# EAGLE design 4x4_numpad (EAGLE 8.3.0)
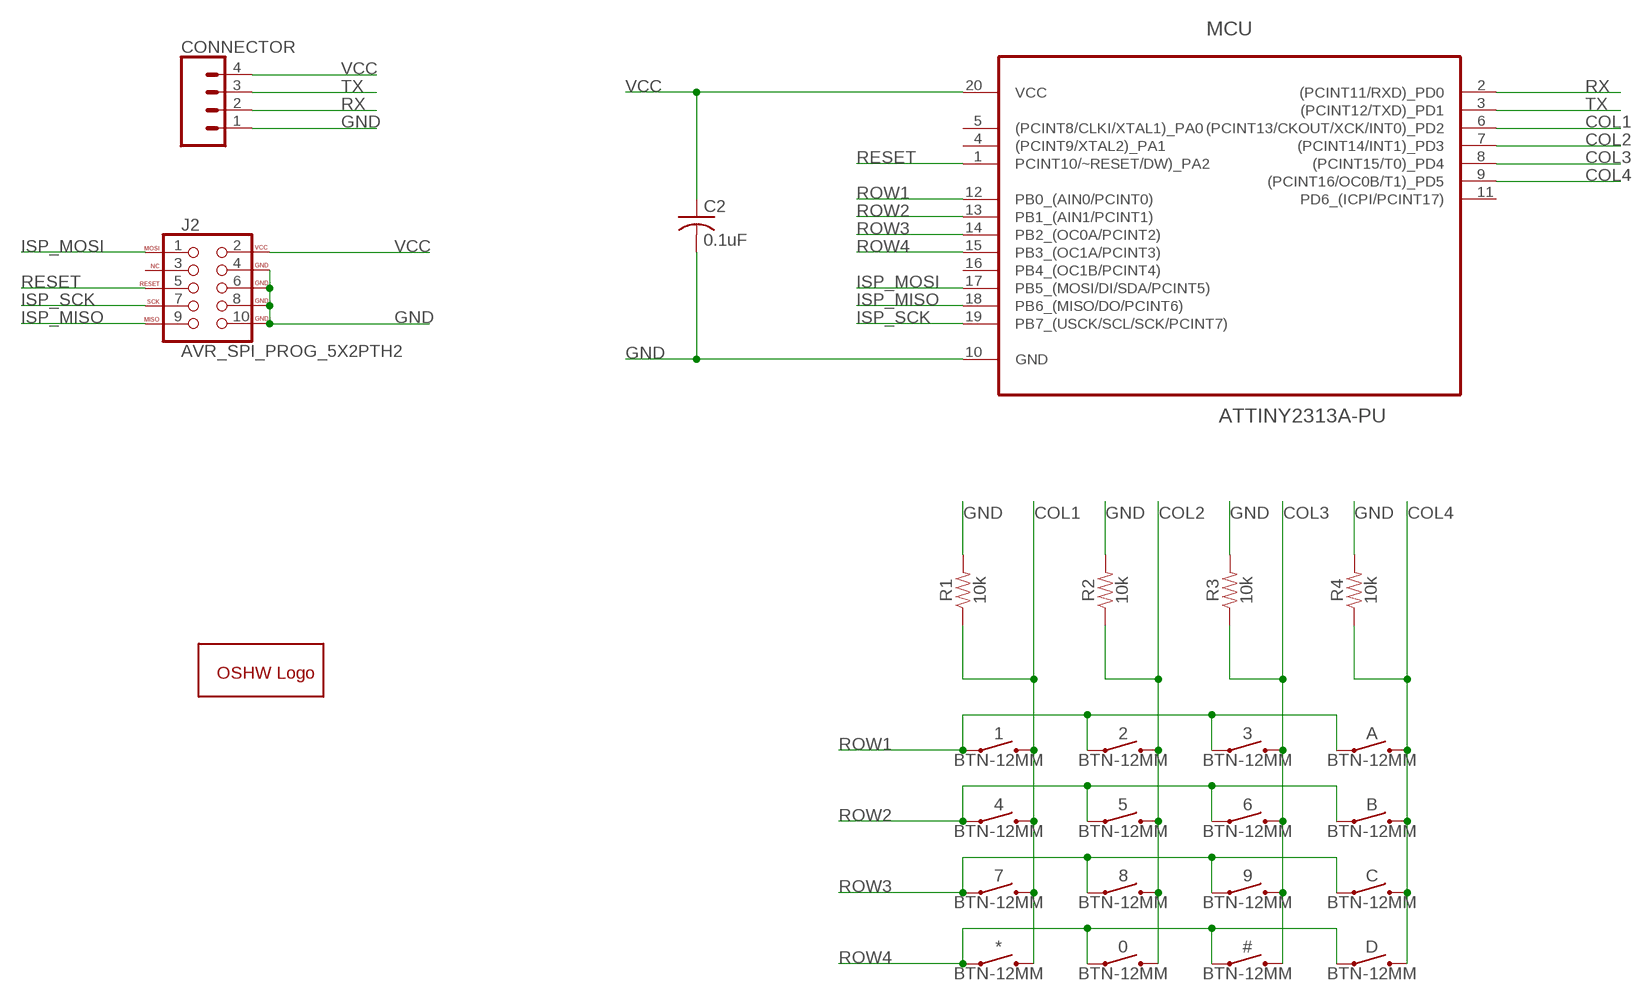
[diagram p0: schematic, sheet 1]

## Parts
0  BTN-12MM  MOMENTARY-SWITCH-SPST-PTH-12MM  [TACTILE_SWITCH_PTH_12MM]
1  BTN-12MM  MOMENTARY-SWITCH-SPST-PTH-12MM  [TACTILE_SWITCH_PTH_12MM]
2  BTN-12MM  MOMENTARY-SWITCH-SPST-PTH-12MM  [TACTILE_SWITCH_PTH_12MM]
3  BTN-12MM  MOMENTARY-SWITCH-SPST-PTH-12MM  [TACTILE_SWITCH_PTH_12MM]
4  BTN-12MM  MOMENTARY-SWITCH-SPST-PTH-12MM  [TACTILE_SWITCH_PTH_12MM]
5  BTN-12MM  MOMENTARY-SWITCH-SPST-PTH-12MM  [TACTILE_SWITCH_PTH_12MM]
6  BTN-12MM  MOMENTARY-SWITCH-SPST-PTH-12MM  [TACTILE_SWITCH_PTH_12MM]
7  BTN-12MM  MOMENTARY-SWITCH-SPST-PTH-12MM  [TACTILE_SWITCH_PTH_12MM]
8  BTN-12MM  MOMENTARY-SWITCH-SPST-PTH-12MM  [TACTILE_SWITCH_PTH_12MM]
9  BTN-12MM  MOMENTARY-SWITCH-SPST-PTH-12MM  [TACTILE_SWITCH_PTH_12MM]
#  BTN-12MM  MOMENTARY-SWITCH-SPST-PTH-12MM  [TACTILE_SWITCH_PTH_12MM]
*  BTN-12MM  MOMENTARY-SWITCH-SPST-PTH-12MM  [TACTILE_SWITCH_PTH_12MM]
A  BTN-12MM  MOMENTARY-SWITCH-SPST-PTH-12MM  [TACTILE_SWITCH_PTH_12MM]
B  BTN-12MM  MOMENTARY-SWITCH-SPST-PTH-12MM  [TACTILE_SWITCH_PTH_12MM]
C  BTN-12MM  MOMENTARY-SWITCH-SPST-PTH-12MM  [TACTILE_SWITCH_PTH_12MM]
C2  0.1uF  C-US050-025X075  [C050-025X075]
CONNECTOR  CONN_04  [1X04]
D  BTN-12MM  MOMENTARY-SWITCH-SPST-PTH-12MM  [TACTILE_SWITCH_PTH_12MM]
GOLD_ORB_SM1  OSHWLOGOLOGO8MM  [OSHW_8MM]
J2  AVR_SPI_PROG_5X2PTH2  [2X5-SHROUDED]
MCU  ATTINY2313A-PU  [DIP254P762X533-20]
R1  10k  10KOHM-HORIZ-1/4W-1%  [AXIAL-0.3]
R2  10k  10KOHM-HORIZ-1/4W-1%  [AXIAL-0.3]
R3  10k  10KOHM-HORIZ-1/4W-1%  [AXIAL-0.3]
R4  10k  10KOHM-HORIZ-1/4W-1%  [AXIAL-0.3]

## Nets
COL1: 1.3 1.4 4.3 4.4 7.3 7.4 *.3 *.4 MCU.6((PCINT13/CKOUT/XCK/INT0)_PD2) R1.P$1
COL2: 0.3 0.4 2.3 2.4 5.3 5.4 8.3 8.4 MCU.7((PCINT14/INT1)_PD3) R2.P$1
COL3: 3.3 3.4 6.3 6.4 9.3 9.4 #.3 #.4 MCU.8((PCINT15/T0)_PD4) R3.P$1
COL4: A.3 A.4 B.3 B.4 C.3 C.4 D.3 D.4 MCU.9((PCINT16/OC0B/T1)_PD5) R4.P$1
GND: C2.2 CONNECTOR.1 J2.4(GND) J2.6(GND) J2.8(GND) J2.10(GND) MCU.10(GND) R1.P$2 R2.P$2 R3.P$2 R4.P$2
ISP_MISO: J2.9(MISO) MCU.18(PB6_(MISO/DO/PCINT6))
ISP_MOSI: J2.1(MOSI) MCU.17(PB5_(MOSI/DI/SDA/PCINT5))
ISP_SCK: J2.7(SCK) MCU.19(PB7_(USCK/SCL/SCK/PCINT7))
RESET: J2.5(RESET) MCU.1(PCINT10/~RESET/DW)_PA2)
ROW1: 1.1 1.2 2.1 2.2 3.1 3.2 A.1 A.2 MCU.12(PB0_(AIN0/PCINT0))
ROW2: 4.1 4.2 5.1 5.2 6.1 6.2 B.1 B.2 MCU.13(PB1_(AIN1/PCINT1))
ROW3: 7.1 7.2 8.1 8.2 9.1 9.2 C.1 C.2 MCU.14(PB2_(OC0A/PCINT2))
ROW4: 0.1 0.2 #.1 #.2 *.1 *.2 D.1 D.2 MCU.15(PB3_(OC1A/PCINT3))
RX: CONNECTOR.2 MCU.2((PCINT11/RXD)_PD0)
TX: CONNECTOR.3 MCU.3((PCINT12/TXD)_PD1)
VCC: C2.1 CONNECTOR.4 J2.2(VCC) MCU.20(VCC)
Unconnected: J2.3(NC) MCU.4((PCINT9/XTAL2)_PA1) MCU.5((PCINT8/CLKI/XTAL1)_PA0) MCU.11(PD6_(ICPI/PCINT17)) MCU.16(PB4_(OC1B/PCINT4))

## Library data of the parts
0 1-9 # * A B C D = SparkFun-Switches:MOMENTARY-SWITCH-SPST: Momentary Switch (Pushbutton) - SPST Normally-open (NO) SPST momentary switches (buttons, pushbuttons). Variants PTH-12MM - 12mm square, through-hole Momentary Pushbutton Switch - 12mm Square <https://www.sparkfun.com/products/9190> (COM-09190) PTH-6.0MM, PTH-6.0MM-KIT - 6.0mm square, through-hole Mini Pushbutton Switch <https://www.sparkfun.com/products/97> (COM-00097) KIT package intended for soldering kit's - only one side of pads' copper is exposed. PTH-RIGHT-ANGLE-KIT - Right-angle, through-hole Right Angle Tactile Button <https://www.sparkfun.com/products/10791> - Used on SparkFun BigTime Watch Kit <https://www.sparkfun.com/products/11734> SMD-12MM - 12mm square, surface-mount Tactile Button - SMD (12mm) <https://www.sparkfun.com/products/12993> (COM-12993) Used on SparkFun PicoBoard <https://www.sparkfun.com/products/11888> SMD-4.5MM - 4.5mm Square Trackball Switch Used on SparkFun Blackberry Trackballer Breakout <https://www.sparkfun.com/products/13169> SMD-4.6MMX2.8MM - 4.60mm x 2.80mm, surface mount Used on SparkFun SAMD21 Mini Breakout <https://www.sparkfun.com/products/13664> SMD-5.2MM, SMD-5.2-REDUNDANT - 5.2mm square, surface-mount Mini Pushbutton Switch - SMD <https://www.sparkfun.com/products/8720> (COM-08720) Used on Arduino Pro Mini <https://www.sparkfun.com/products/11114> REDUNDANT package connects both switch circuits together SMD-6.0X3.5MM - 6.0 x 3.5mm, surface mount Momentary Reset Switch SMD <https://www.sparkfun.com/products/8229> (COM-08229) SMD-6.2MM-TALL - 6.2mm square, surface mount Tactile Button - SMD (6mm) <https://www.sparkfun.com/products/12992> Used on SparkFun Digital Sandbox <https://www.sparkfun.com/products/12651> SMD-RIGHT-ANGLE - Right-angle, surface mount Used on SparkFun Block for Intel® Edison - Arduino <https://www.sparkfun.com/products/13036>; PROD_ID: SWCH-09185; SF_SKU: COM-09190
C2 = resistor:C-US: CAPACITOR, American symbol
CONNECTOR = SparkFun-Connectors:CONN_04: Multi connection point. Often used as Generic Header-pin footprint for 0.1 inch spaced/style header connections On any of the 0.1 inch spaced packages, you can populate with these: Break Away Headers - Straight <https://www.sparkfun.com/products/116> (PRT-00116) Break Away Male Headers - Right Angle <https://www.sparkfun.com/products/553> (PRT-00553) Female Headers <https://www.sparkfun.com/products/115> (PRT-00115) Break Away Headers - Machine Pin <https://www.sparkfun.com/products/117> (PRT-00117) Break Away Female Headers - Swiss Machine Pin <https://www.sparkfun.com/products/743> (PRT-00743) For SCREWTERMINALS and SPRING TERMINALS visit here: Screw Terimnals on SparkFun.com <https://www.sparkfun.com/search/results?term=Screw+Terminals> (5mm/3.5mm/2.54mm spacing) This device is also useful as a general connection point to wire up your design to another part of your project. Our various solder wires solder well into these plated through hole pads. Hook-Up Wire - Assortment (Stranded, 22 AWG) <https://www.sparkfun.com/products/11375> (PRT-11375) Hook-Up Wire - Assortment (Solid Core, 22 AWG) <https://www.sparkfun.com/products/11367> (PRT-11367) View the entire wire category on our website here <https://www.sparkfun.com/categories/141> Special notes: Molex polarized connector foot print use with SKU : PRT-08231 with associated crimp pins and housings. 1MM SMD Version SKU: PRT-10208; PROD_ID: CONN-09696
GOLD_ORB_SM1 = oshw:OSHWLOGO: The OSHW logo for PCB layout
J2 = SparkFun-Connectors:AVR_SPI_PROG_5X2: AVR 10-pin ICSP Header This is the standard AVR In Circuit Serial Programming header. Minimal, but includes pin one indicator. Works with standard Olimex programmers. SparkFun Products: 2x5 AVR ICSP Male Header <https://www.sparkfun.com/products/778> - PTH 2x5 Pin Shrouded Header <https://www.sparkfun.com/products/8506> - PTH2; PROD_ID: CONN-08671; SF_ID: PRT-08506
MCU = Atmel_By_element14_Batch_1-00:ATTINY2313A-PU: 8-bit Microcontroller; DESCRIPTION: 8-bit Microcontroller; MPN: ATTINY2313A-PU; OC_FARNELL: 1841616; OC_NEWARK: 12T1333; PACKAGE: DIP-20; SUPPLIER: Atmel
R1-R4 = SparkFun-Resistors:10KOHM: 10kΩ resistor A resistor is a passive two-terminal electrical component that implements electrical resistance as a circuit element. Resistors act to reduce current flow, and, at the same time, act to lower voltage levels within circuits. - Wikipedia; PROD_ID: RES-12183

## Board
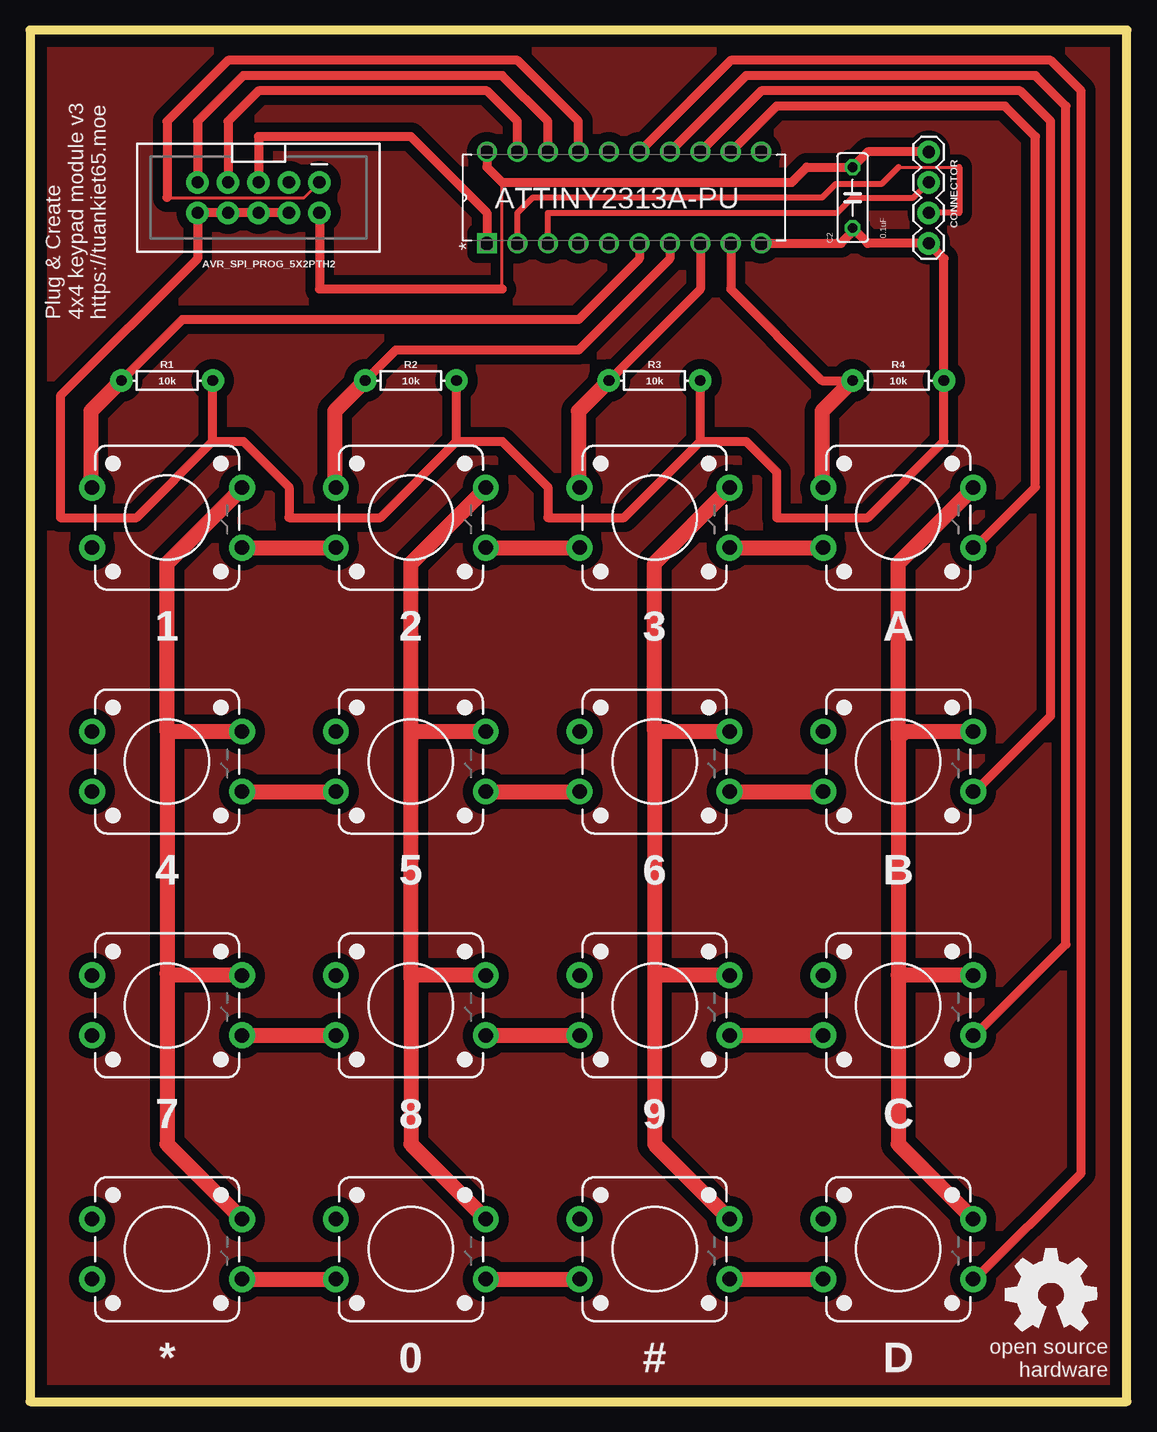
[diagram p1: board, top side]
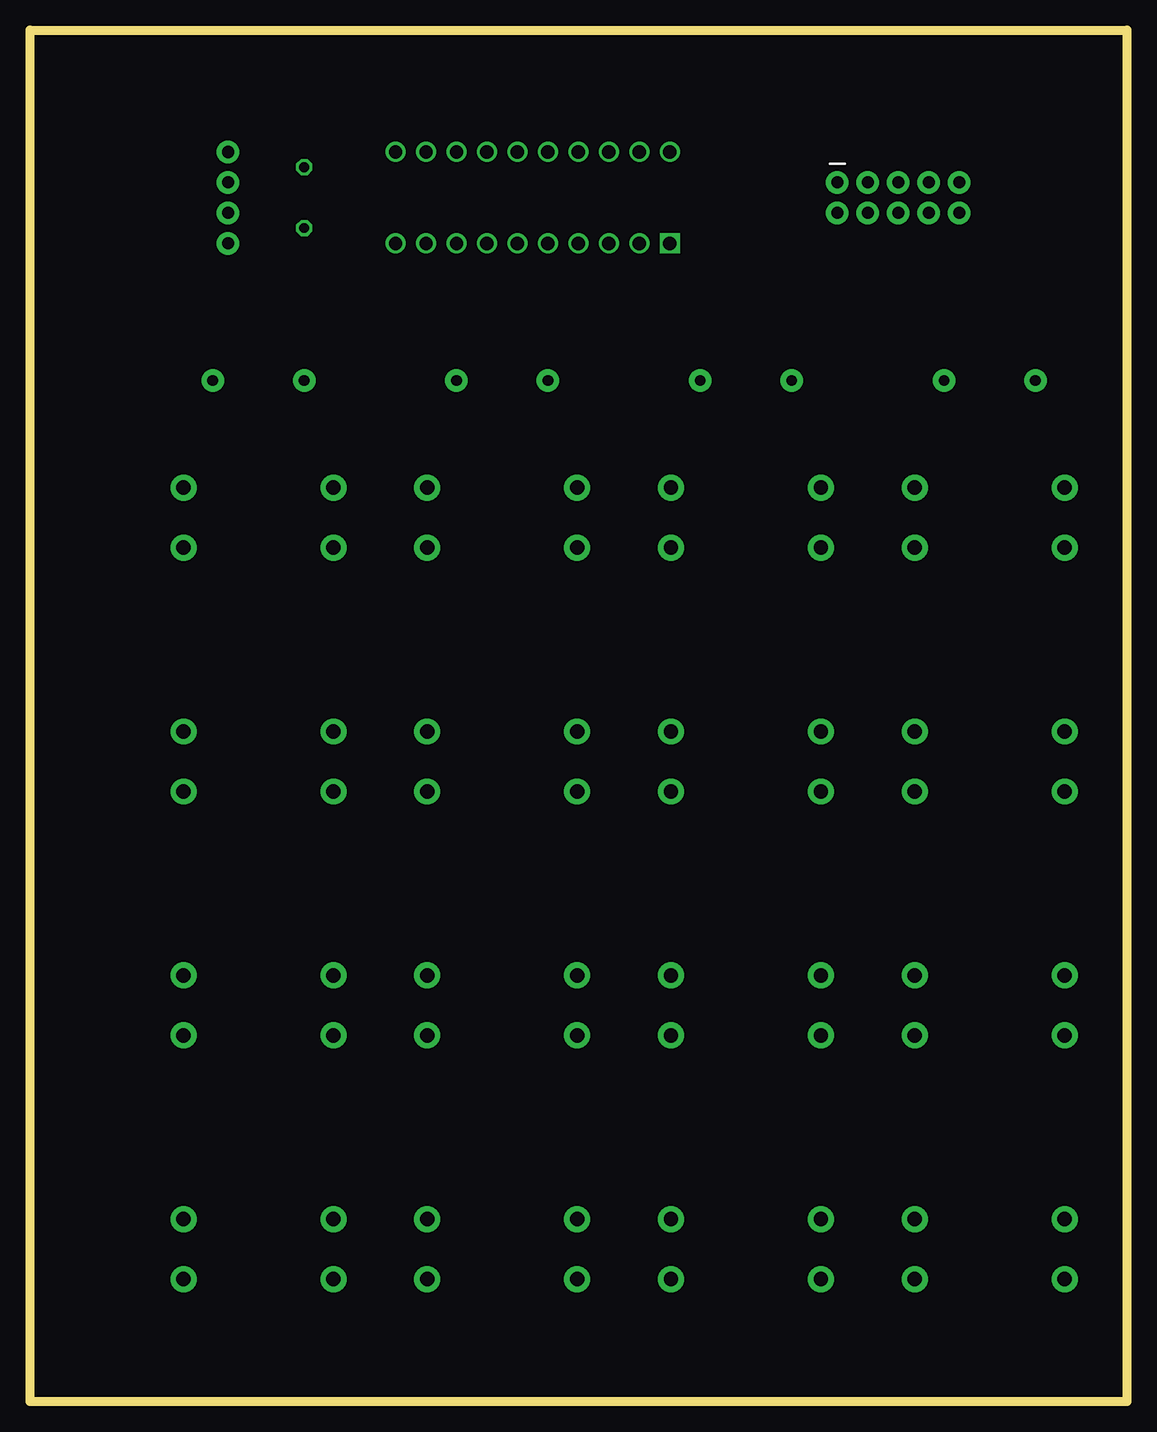
[diagram p2: board, bottom side, seen from below]

Size 91.44 x 114.3 mm. Coordinates in mm from the lower left corner, seen from the top.
Outline: 0,0 91.44,0 91.44,114.3 0,114.3 0,0
Copper layers (1*16): Top 0.035mm / dielectric 1.5mm / Bottom 0.035mm
Design rules "default": minimum track width 6mil, minimum drill 0.35mm, track to track 6mil, track to pad 6mil, pad to pad 6mil, via to via 6mil, smd to smd 6mil, copper to edge 40mil, drill to drill 6mil, minimum pad ring 10mil, minimum via ring 8mil, stop-mask expansion 4mil, vias tented up to drill 0mil, thermal gap 10mil

### Footprints (pad centres in the part's own frame; a part is rotated, then mirrored left to right if it is on the bottom)
TACTILE_SWITCH_PTH_12MM = drill 1.2 pad 2.159: 1 6.25,-2.5; 2 -6.25,-2.5; 3 6.25,2.5; 4 -6.25,2.5
C050-025X075 = drill 0.813 octagon: 1 -2.54,0; 2 2.54,0
1X04 = drill 1.016 pad 1.88: 1 0,0; 2 2.54,0; 3 5.08,0; 4 7.62,0
2X5-SHROUDED = drill 1.016 pad 1.88: 1 -1.27,5.08; 2 1.27,5.08; 3 -1.27,2.54; 4 1.27,2.54; 5 -1.27,0; 6 1.27,0; 7 -1.27,-2.54; 8 1.27,-2.54; 9 -1.27,-5.08; 10 1.27,-5.08
DIP254P762X533-20 = drill 1.118 square: 1 -7.62,22.86 | drill 1.118: 2 -7.62,20.32; 3 -7.62,17.78; 4 -7.62,15.24; 5 -7.62,12.7; 6 -7.62,10.16; 7 -7.62,7.62; 8 -7.62,5.08; 9 -7.62,2.54; 10 -7.62,0; 11 0,0; 12 0,2.54; 13 0,5.08; 14 0,7.62; 15 0,10.16; 16 0,12.7; 17 0,15.24; 18 0,17.78; 19 0,20.32; 20 0,22.86
AXIAL-0.3 = drill 0.9 pad 1.88: P$1 -3.81,0; P$2 3.81,0

### Placement (x,y rotation side)
0  31.75,12.7 0 top
1  11.43,73.66 0 top
2  31.75,73.66 0 top
3  52.07,73.66 0 top
4  11.43,53.34 0 top
5  31.75,53.34 0 top
6  52.07,53.34 0 top
7  11.43,33.02 0 top
8  31.75,33.02 0 top
9  52.07,33.02 0 top
#  52.07,12.7 0 top
*  11.43,12.7 0 top
A  72.39,73.66 0 top
B  72.39,53.34 0 top
C  72.39,33.02 0 top
C2  68.58,100.33 270 top
CONNECTOR  74.93,96.52 90 top
D  72.39,12.7 0 top
GOLD_ORB_SM1  85.09,8.89 0 top
J2  19.05,100.33 270 top
MCU  60.96,104.14 90 top
R1  11.43,85.09 0 top
R2  31.75,85.09 0 top
R3  52.07,85.09 0 top
R4  72.39,85.09 0 top

### Tracks (layer width: path | path; a pad name or v marks a point on that pad's centre or on a via)
COL1
  Top 0.762: MCU.6 50.8,95.25 45.72,90.17 12.7,90.17 R1.P$1
  Top 1.27: R1.P$1 5.08,82.55 5.08,76.26 1.4 | 1.3 17.68,76.1 11.43,69.85 11.43,55.88 | 11.43,55.88 11.43,35.67 | 11.43,35.67 11.43,21.45 *.3 | 7.3 11.58,35.52 11.43,35.67 | 4.3 11.47,55.84 11.43,55.88
COL2
  Top 0.508: 25.65,35.56 8.4
  Top 0.762: MCU.7 53.34,95.25 45.72,87.63 30.48,87.63 R2.P$1
  Top 1.27: R2.P$1 25.4,82.55 25.4,76.26 2.4 | 2.3 38,76.1 31.75,69.85 31.75,55.88 | 31.75,35.3 31.75,55.88 | 31.75,35.3 31.75,21.45 0.3 | 5.3 31.79,55.84 31.75,55.88 | 8.3 31.97,35.52 31.75,35.3
COL3
  Top 0.762: MCU.8 55.88,92.71 R3.P$1
  Top 1.27: 3.3 58.32,76.1 52.07,69.85 52.07,55.88 | 52.07,55.88 52.07,35.56 | 52.07,35.56 52.07,21.45 #.3 | 9.3 52.11,35.52 52.07,35.56 | 6.3 52.11,55.84 52.07,55.88 | R3.P$1 45.72,82.55 45.72,76.26 3.4
COL4
  Top 0.762: MCU.9 58.42,92.71 66.04,85.09 R4.P$1
  Top 1.27: A.3 78.64,76.1 72.39,69.85 72.39,55.27 | 72.39,55.27 72.39,35.56 | 72.39,35.56 72.39,21.45 D.3 | C.3 72.43,35.52 72.39,35.56 | B.3 72.96,55.84 72.39,55.27 | A.4 66.04,76.26 66.04,82.55 R4.P$1
GND
  Top 0.762: J2.4 J2.6 J2.8 J2.10 13.97,95.25 2.54,83.82 2.54,73.66 8.89,73.66 15.24,80.01 | 15.24,80.01 R1.P$2 | 15.24,80.01 17.78,80.01 21.59,76.2 21.59,73.66 29.21,73.66 35.56,80.01 | 35.56,80.01 R2.P$2 | 35.56,80.01 39.37,80.01 43.18,76.2 43.18,73.66 49.53,73.66 55.88,80.01 | 55.88,80.01 R3.P$2 | 55.88,80.01 59.69,80.01 62.23,77.47 62.23,73.66 69.85,73.66 76.2,80.01 R4.P$2 76.2,95.25 CONNECTOR.1 69.85,96.52 68.74,97.63 | 68.74,97.63 C2.2 | MCU.10 67.62,96.52 68.74,97.63
ISP_MISO
  Top 0.762: J2.9 13.97,106.68 17.78,110.49 39.37,110.49 43.18,106.68 MCU.18
ISP_MOSI
  Top 0.254: 11.43,100.33 22.86,100.33 J2.1
  Top 0.762: MCU.17 45.72,106.68 40.64,111.76 16.51,111.76 11.43,106.68 11.43,100.33
ISP_SCK
  Top 0.762: MCU.19 40.64,106.68 38.1,109.22 19.05,109.22 16.51,106.68 J2.7
N$2
  pour Top (isolate 0.813): 0,114.3 91.44,114.3 91.44,0 0,0
RESET
  Top 0.762: MCU.1 38.1,99.06 31.75,105.41 19.05,105.41 J2.5
ROW1
  Top 0.762: A.1 78.78,71.16 83.82,76.2 83.82,105.41 81.28,107.95 62.23,107.95 MCU.12
  Top 1.27: 3.1 A.2 | 2.1 3.2 | 1.1 2.2
ROW2
  Top 0.762: B.1 78.78,50.84 85.09,57.15 85.09,106.68 82.55,109.22 60.96,109.22 MCU.13
  Top 1.27: 4.1 5.2 | 5.1 6.2 | 6.1 B.2
ROW3
  Top 0.762: C.1 78.78,30.52 86.36,38.1 86.36,107.95 83.82,110.49 59.69,110.49 MCU.14
  Top 1.27: 7.1 8.2 | 8.1 9.2 | 9.1 C.2
ROW4
  Top 0.762: D.1 78.78,10.2 87.63,19.05 87.63,109.22 85.09,111.76 58.42,111.76 MCU.15
  Top 1.27: *.1 0.2 | 0.1 #.2 | #.1 D.2
RX
  Top 0.254: 72.39,102.87 72.4,102.87 77.47,102.87
  Top 0.508: MCU.2 40.64,99.06 41.91,100.33 66.04,100.33 67.16,101.45 70.97,101.45 72.4,102.87 | 77.47,102.87 77.47,99.06 CONNECTOR.2
TX
  Top 0.508: MCU.3 43.18,99.06 67.31,99.06 68.58,100.33 73.66,100.33 CONNECTOR.3
VCC
  Top 0.254: 39.37,92.71 39.37,101.6
  Top 0.762: J2.2 24.13,92.71 39.37,92.71 | MCU.20 38.1,102.87 39.37,101.6 63.5,101.6 64.77,102.87 C2.1 68.78,103.07 69.85,104.14 CONNECTOR.4

### Text on the board
tPlace: Plug & Create / 4x4 keypad module v3 / https://tuankiet65.moe